# Altium schematic sheet sch_Hakko907-Controler_2021-11-16.schdoc
size 288 x 213 mm
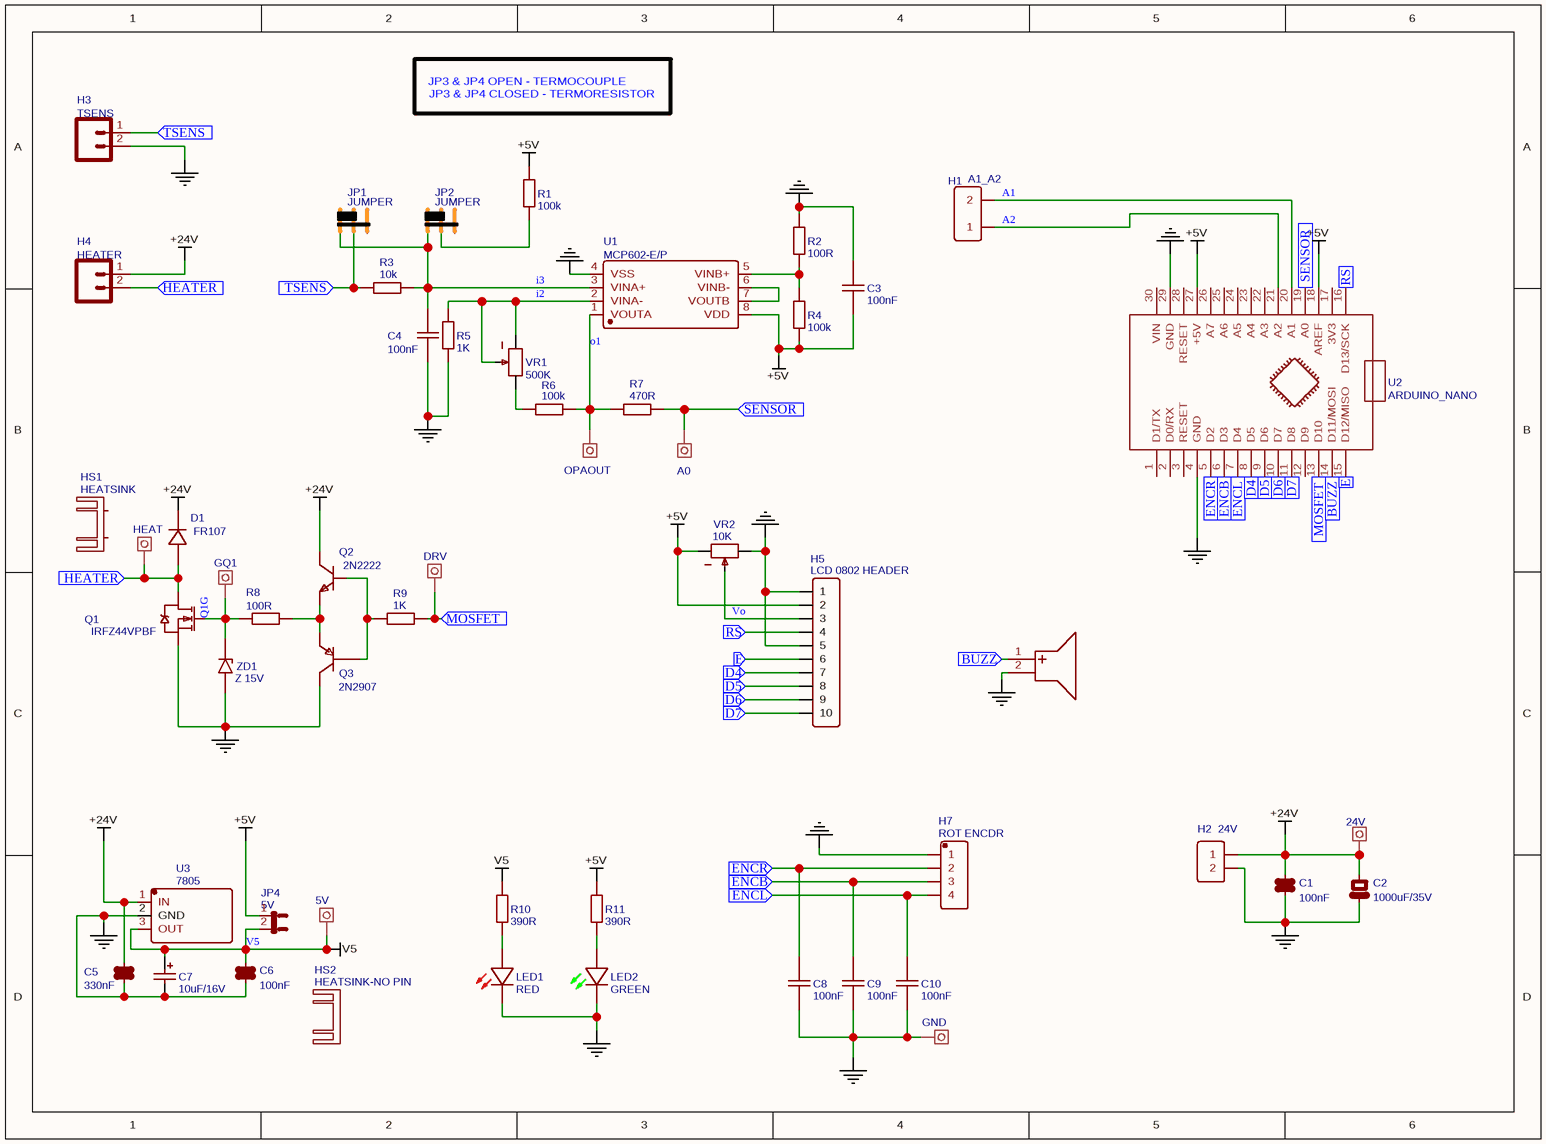
[diagram p0: sch_Hakko907-Controler_2021-11-16.schdoc]

## Parts
BUZZER1  LD-BZEG-1203  [BUZZER-LD-BZEG-1203]  (value not drawn)
C1  100nF  [CERAMIC-5.08-NEW]
C2  1000uF/35V  [CPOL_5_D13_V20.5]
C3  100nF  [CERAMIC-5.08-NEW]
C4  100nF  [CERAMIC-5.08-NEW]
C5  330nF  [CERAMIC-5.08-NEW]
C6  100nF  [CERAMIC-5.08-NEW]
C7  10uF/16V  [CASE-C_6032-NEW]
C8  100nF  [C_1206]
C9  100nF  [C_1206]
C10  100nF  [C_1206]
D1  FR107  [DO-41_10MM]
H1  A1_A2  [DIP-1X2P-2.54MM-M-OVAL_PAD]
H2  24V  [B2P_VH_M-3.96]
H3  TSENS  [XH_PW10-02-M_2.54MM]
H4  HEATER  [B2P_VH_M-3.96]
H5  LCD 0802 HEADER  [DIP-1X10P-2.54MM-M-OVAL_PAD]
H7  ROT ENCDR  [DIP-1X4P-2.54MM-M-OVAL_PAD]
HS1  HEATSINK  [HEATSINK-25X29X12MM]
HS2  HEATSINK-NO PIN  [HEATSINK 8X17.4X25.5]
JP1  JUMPER  [1X03_JUMPER]
JP2  JUMPER  [1X03_JUMPER]
JP4  5V  [1X02_JUMPER]
LED1  RED  [LED_1206_RED]
LED2  GREEN  [LED_1206_GREEN]
Q1  IRFZ44VPBF  [TO-220_V]
Q2  2N2222  [SOT-23_TO-92]
Q3  2N2907  [SOT-23_TO-92]
R1  100k  [R_1206]
R2  100R  [AXIAL-0.3-OVAL PAD]
R3  10k  [AXIAL-0.3-OVAL PAD]
R4  100k  [AXIAL-0.3-OVAL PAD]
R5  1K  [AXIAL-0.3-OVAL PAD]
R6  100k  [R_1206]
R7  470R  [AXIAL-0.3-OVAL PAD]
R8  100R  [AXIAL-0.3-OVAL PAD]
R9  1K  [AXIAL-0.3-OVAL PAD]
R10  390R  [R_1206]
R11  390R  [R_1206]
TP1  24V  [HDR-1X1/2.54-TEST_POINT]
TP2  DRV  [HDR-1X1/2.54-TEST_POINT]
TP3  5V  [HDR-1X1/2.54-TEST_POINT]
TP4  GND  [HDR-1X1/2.54-TEST_POINT]
TP5  OPAOUT  [HDR-1X1/2.54-TEST_POINT]
TP6  GQ1  [HDR-1X1/2.54-TEST_POINT]
TP7  A0  [HDR-1X1/2.54-TEST_POINT]
TP8  HEAT  [HDR-1X1/2.54-TEST_POINT]
U1  MCP602-E/P  [DIP-8]
U2  ARDUINO_NANO  [ARDUINO_NANO_NEW]
U3  7805  [TO-220_V]
VR1  500K  [3296X]
VR2  10K  [3296X]
ZD1  Z 15V  [DO-41_10MM_ZENNER]

## Ports
BUZZ (in), D4 (in), D5 (in), D6 (in), D7 (in), E (in), ENCB (in), ENCL (in), ENCR (in), HEATER (in), MOSFET (in), RS (in), SENSOR (in), TSENS (in)

## Nets
+5V: C3.1 H5.2 JP4.1 R1.2 R4.2 R11.2 U1.8(VDD) U2.18(AREF) U2.27(+5V) VR2.1
+24V: C1.1 C2.1(+) C5.1 D1.2(K) H2.1 H4.1 Q2.3(C) TP1.1 U3.1(IN)
GND: BUZZER1.2(-) C1.2 C2.2(-) C3.2 C4.1 C5.2 C6.2 C7.2 C8.2 C9.1 C10.1 H2.2 H3.2 H5.1 H5.5 H7.1 LED1.2(K) LED2.2(K) Q1.3(S) Q3.3(C) R2.1 R5.1 TP4.1 U1.4(VSS) U2.4(GND) U2.29(GND) U3.2(GND) VR2.3 ZD1.1
V5: C6.1 C7.1 JP4.2 R10.2 TP3.1 U3.3(OUT)
A1: H1.2 U2.20(A1)
A2: H1.1 U2.21(A2)
BUZZ: BUZZER1.1(+) U2.14(D11/MOSI) ; port BUZZ
D4: H5.7 U2.8(D5) ; port D4
D5: H5.8 U2.9(D6) ; port D5
D6: H5.9 U2.10(D7) ; port D6
D7: H5.10 U2.11(D8) ; port D7
E: H5.6 U2.15(D12/MISO) ; port E
ENCB: C9.2 H7.3 U2.6(D3) ; port ENCB
ENCL: C10.2 H7.4 U2.7(D4) ; port ENCL
ENCR: C8.1 H7.2 U2.5(D2) ; port ENCR
HEATER: D1.1(A) H4.2 Q1.2(D) TP8.1 ; port HEATER
i2: R5.2 U1.2(VINA-) VR1.1 VR1.2
i3: C4.2 JP1.1 JP2.1 R3.2 U1.3(VINA+)
MOSFET: R9.2 TP2.1 U2.13(D10) ; port MOSFET
o1: R6.2 R7.1 TP5.1 U1.1(VOUTA)
Q1G: Q1.1(G) R8.1 TP6.1 ZD1.2
RS: H5.4 U2.16(D13/SCK) ; port RS
SENSOR: R7.2 TP7.1 U2.19(A0) ; port SENSOR
TSENS: H3.1 JP1.2 R3.1 ; port TSENS
Vo: H5.3 VR2.2
NetJP2_2: JP2.2 R1.1
NetLED1_1: LED1.1(A) R10.1
NetLED2_1: LED2.1(A) R11.1
NetQ2_1: Q2.1(E) Q3.1(E) R8.2
NetQ2_2: Q2.2(B) Q3.2(B) R9.1
NetR2_2: R2.2 R4.1 U1.5(VINB+)
NetR6_1: R6.1 VR1.3
NetU1_6: U1.6(VINB-) U1.7(VOUTB)

Not connected (* = marked no-connect by the designer): HS1 1; JP1 3; JP2 3; U2 1(D1/TX) 2(D0/RX) 3(RESET) 12(D9) 17(3V3) 22(A3) 23(A4) 24(A5) 25(A6) 26(A7) 28(RESET) 30(VIN)

## Notes on the sheet
- JP3 & JP4 OPEN - TERMOCOUPLE
- JP3 & JP4 CLOSED - TERMORESISTOR

## Library data of the parts
BUZZER1 = LD-BZEG-1203: BOM_Manufacturer: Dongguan Bolin Elec; BOM_Manufacturer Part: BL-PBZ12065C2005YB; Contributor: LCSC; BOM_Supplier: LCSC; BOM_Supplier Part: C187880; spicePre: B
C1 C6 = 100nF: Contributor: Yancho Zapryanov; BOM_Manufacturer Part: ?; spicePre: C
C2 = 1000uF/35V: Contributor: Yancho Zapryanov; BOM_Manufacturer Part: ?; spicePre: C
C3 C4 C8-C10 = 100nF: BOM_Manufacturer Part: K104K15X7RF53H5; Contributor: NuttyProfessor47; BOM_Supplier Part: 852-3270; BOM_Supplier: RS-Online; spicePre: C
C5 = 330nF: Contributor: Yancho Zapryanov; BOM_Manufacturer Part: ?; spicePre: C
C7 = 10uF/16V: BOM_Manufacturer: AVX; BOM_Manufacturer Part: TAJB107M010RNJ; nameAlias: Capacitance; SMT Type: Extend; BOM_Supplier: LCSC; BOM_Supplier Part: C7196; BOM_LCSC Assembly: Yes; spicePre: C; spiceSymbolName: TAJB107M010RNJ
D1 = FR107: BOM_Manufacturer Part: FR207; BOM_Manufacturer: MDD; BOM_Supplier: LCSC; image: //image.lceda.cn/szlcsc/C2468.jpg; BOM_Supplier Part: C2468; spicePre: D
H1 = A1_A2: BOM_Manufacturer: TE Connectivity; BOM_Manufacturer Part: 826629-2; BOM_Supplier: LCSC; image: //image.lceda.cn/szlcsc/C86471.jpg; BOM_Supplier Part: C86471; spicePre: H
H2 = 24V: BOM_Manufacturer: BOOMELE; BOM_Manufacturer Part: 2.54-1*2PFemale; BOM_Supplier: LCSC; image: //image.lceda.cn/szlcsc/C49661.jpg; BOM_Supplier Part: C49661; spicePre: P
H3 = TSENS: Contributor: SparkFun; BOM_Manufacturer Part: ?; spicePre: J
H4 = HEATER: Contributor: SparkFun; BOM_Manufacturer Part: ?; spicePre: J
H5 = LCD 0802 HEADER: BOM_Manufacturer Part: Headers  Pins2.54mm1*10P; BOM_Supplier: LCSC; image: http://image.lceda.cn/szlcsc/C57369.jpg; BOM_Supplier Part: C57369; spicePre: P
H7 = ROT ENCDR: BOM_Manufacturer: Ckmtw; BOM_Manufacturer Part: 210S-1*4P L=11.6MMGold-plated black; Contributor: LCSC; BOM_Supplier: LCSC; BOM_Supplier Part: C124378; spicePre: H
HS1 = HEATSINK: sourceId: MgrpnlVuQ; Contributor: Yancho Zapryanov; timeStamp: 1452349119; spicePre: H
HS2 = HEATSINK-NO PIN: sourceId: MgrpnlVuQ; Contributor: Yancho Zapryanov; timeStamp: 1452349119; spicePre: H
JP1 JP2 = JUMPER: nameAlias: Resistance (Ohms); Contributor: Yancho Zapryanov; spicePre: J; spiceSymbolName: JUMPER
JP4 = 5V: description: Jumper; Contributor: SparkFun; BOM_Manufacturer Part: ?; spicePre: J
LED1 = RED: Contributor: Yancho Zapryanov; spicePre: L
LED2 = GREEN: Contributor: Yancho Zapryanov; spicePre: L
Q1 = IRFZ44VPBF: BOM_Manufacturer: Infineon Technologies; Contributor: LCSC; BOM_Supplier: LCSC; BOM_Supplier Part: C165276; BOM_Manufacturer Part: IRFZ44VPBF; spicePre: Q
Q2 = 2N2222: BOM_Manufacturer: SEMTECH; Contributor: LCSC; BOM_Supplier: LCSC; BOM_Manufacturer Part: 2N2222; BOM_Supplier Part: C118536; spicePre: Q
Q3 = 2N2907: BOM_Manufacturer: SEMTECH; BOM_Supplier: LCSC; BOM_Manufacturer Part: 2N2907; BOM_Supplier Part: C118537; spicePre: Q
R1 R4 R6 = 100k: BOM_Manufacturer: KOA Speer Elec; BOM_Manufacturer Part: MF1/4CCT52A1002F; nameAlias: Resistance (Ohms); Contributor: LCSC; BOM_Supplier: LCSC; BOM_Supplier Part: C202434; spicePre: R; spiceSymbolName: MF1/4CCT52A1002F
R2 R8 = 100R: BOM_Manufacturer: KOA Speer Elec; BOM_Manufacturer Part: MF1/4CCT52A1002F; nameAlias: Resistance (Ohms); Contributor: LCSC; BOM_Supplier: LCSC; BOM_Supplier Part: C202434; spicePre: R; spiceSymbolName: MF1/4CCT52A1002F
R3 = 10k: BOM_Manufacturer: KOA Speer Elec; BOM_Manufacturer Part: MF1/4CCT52A1002F; nameAlias: Resistance (Ohms); Contributor: LCSC; BOM_Supplier: LCSC; BOM_Supplier Part: C202434; spicePre: R; spiceSymbolName: MF1/4CCT52A1002F
R5 R9 = 1K: BOM_Manufacturer: KOA Speer Elec; BOM_Manufacturer Part: MF1/4CCT52A1002F; nameAlias: Resistance (Ohms); Contributor: LCSC; BOM_Supplier: LCSC; BOM_Supplier Part: C202434; spicePre: R; spiceSymbolName: MF1/4CCT52A1002F
R7 = 470R: BOM_Manufacturer: KOA Speer Elec; BOM_Manufacturer Part: MF1/4CCT52A1002F; nameAlias: Resistance (Ohms); Contributor: LCSC; BOM_Supplier: LCSC; BOM_Supplier Part: C202434; spicePre: R; spiceSymbolName: MF1/4CCT52A1002F
R10 R11 = 390R: BOM_Manufacturer: YAGEO; BOM_Manufacturer Part: RC1210FR-074K3L; nameAlias: Resistance (Ohms); Contributor: LCSC; BOM_Supplier: LCSC; BOM_Supplier Part: C309588; spicePre: R; spiceSymbolName: RC1210FR-074K3L
TP1 = 24V: Contributor: Yancho Zapryanov; BOM_Manufacturer Part: ?; spicePre: T
TP2 = DRV: Contributor: Yancho Zapryanov; BOM_Manufacturer Part: ?; spicePre: T
TP3 = 5V: Contributor: Yancho Zapryanov; BOM_Manufacturer Part: ?; spicePre: T
TP4 = GND: Contributor: Yancho Zapryanov; BOM_Manufacturer Part: ?; spicePre: T
TP5 = OPAOUT: Contributor: Yancho Zapryanov; BOM_Manufacturer Part: ?; spicePre: T
TP6 = GQ1: Contributor: Yancho Zapryanov; BOM_Manufacturer Part: ?; spicePre: T
TP7 = A0: Contributor: Yancho Zapryanov; BOM_Manufacturer Part: ?; spicePre: T
TP8 = HEAT: Contributor: Yancho Zapryanov; BOM_Manufacturer Part: ?; spicePre: T
U1 = MCP602-E/P: BOM_Manufacturer: Microchip Tech; Contributor: LCSC; BOM_Supplier: LCSC; BOM_Supplier Part: C115808; BOM_Manufacturer Part: MCP602-E/P; spicePre: U
U2 = ARDUINO_NANO: sourceId: KGSeAWhDB; timeStamp: 1452340004; BOM_Manufacturer Part: ?; spicePre: U
U3 = 7805: BOM_Manufacturer: Foshan Blue Rocket Elec; Contributor: LCSC; BOM_Supplier: LCSC; BOM_Supplier Part: C305416; BOM_Manufacturer Part: 7805; spicePre: U
VR1 = 500K: nameAlias: Resistance(Ohms); Contributor: Yancho Zapryanov; BOM_Manufacturer Part: ?; spicePre: V; spiceSymbolName: TRIM-POT
VR2 = 10K: nameAlias: Resistance(Ohms); Contributor: Yancho Zapryanov; BOM_Manufacturer Part: ?; spicePre: V; spiceSymbolName: TRIM-POT
ZD1 = Z 15V: Contributor: Yancho Zapryanov; timeStamp: 1472323602; BOM_Manufacturer Part: ?; spicePre: Z